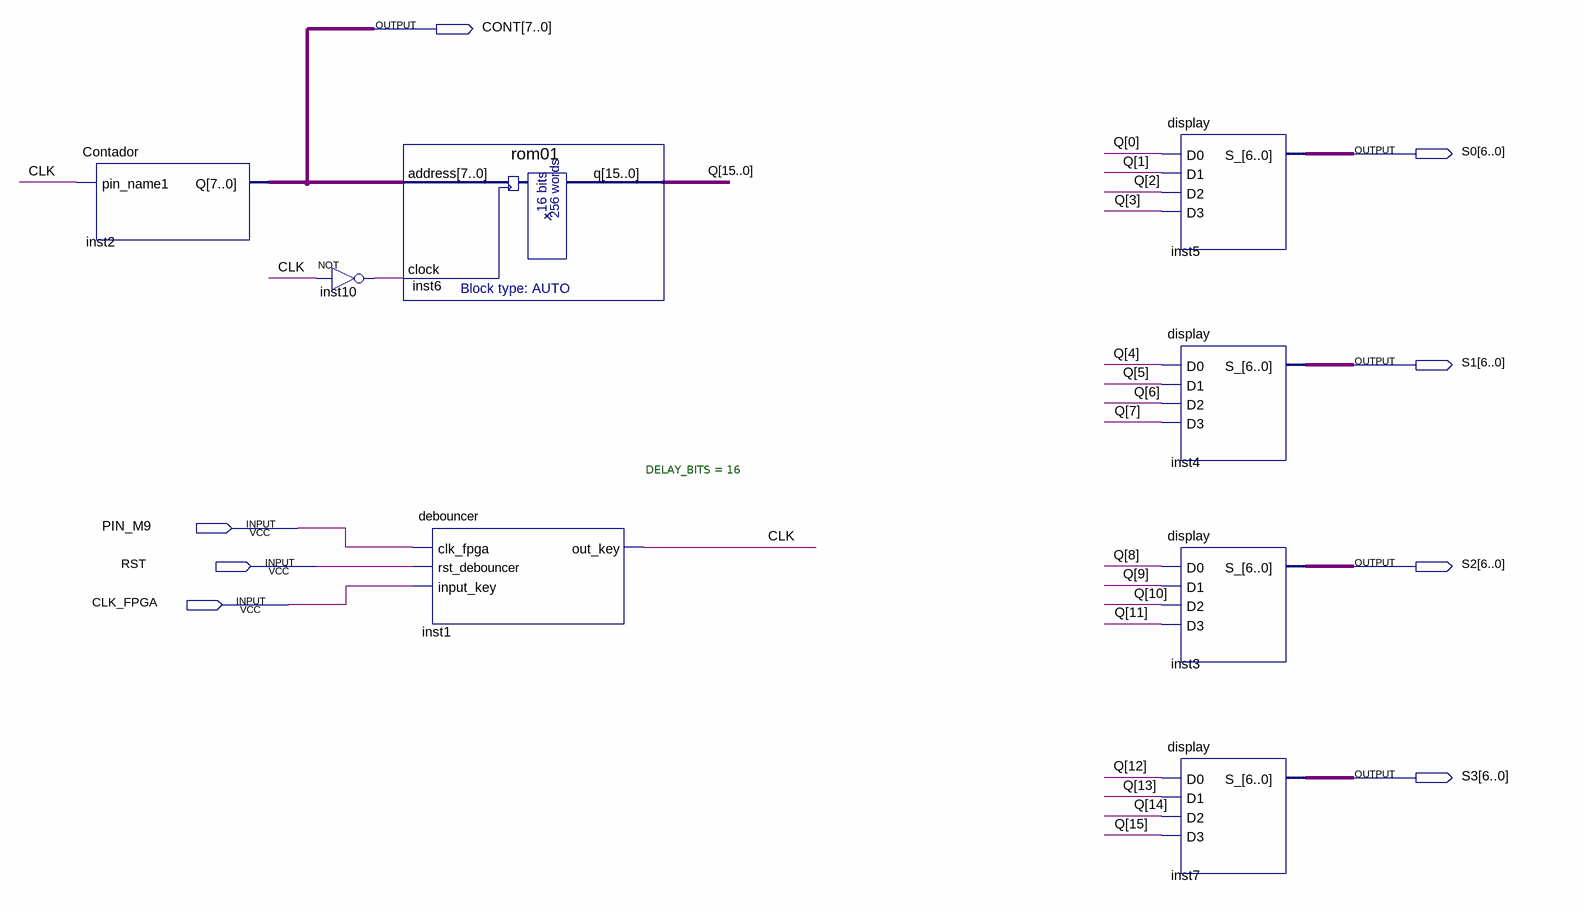
[diagram p0: schematic sheet]
// Quartus schematic Memoria.bdf as structural Verilog: 8 symbols, 8 pins
module Memoria (
  input  PIN_M9,
  input  RST,
  input  CLK_FPGA,
  output [7:0] CONT,
  output [6:0] S0,
  output [6:0] S1,
  output [6:0] S2,
  output [6:0] S3
);

  wire CLK, inst10_out;
  wire [15:0] Q;

  Contador inst2 (.pin_name1(CLK), .Q(CONT));
  not inst10 (inst10_out, CLK);
  rom01 inst6 (.address(CONT), .clock(inst10_out), .q(Q));
  debouncer #(.DELAY_BITS(16)) inst1 (.clk_fpga(PIN_M9), .rst_debouncer(RST), .input_key(CLK_FPGA), .out_key(CLK));
  display inst5 (.D0(Q[0]), .D1(Q[1]), .D2(Q[2]), .D3(Q[3]), .S_(S0));
  display inst4 (.D0(Q[4]), .D1(Q[5]), .D2(Q[6]), .D3(Q[7]), .S_(S1));
  display inst3 (.D0(Q[8]), .D1(Q[9]), .D2(Q[10]), .D3(Q[11]), .S_(S2));
  display inst7 (.D0(Q[12]), .D1(Q[13]), .D2(Q[14]), .D3(Q[15]), .S_(S3));
endmodule
